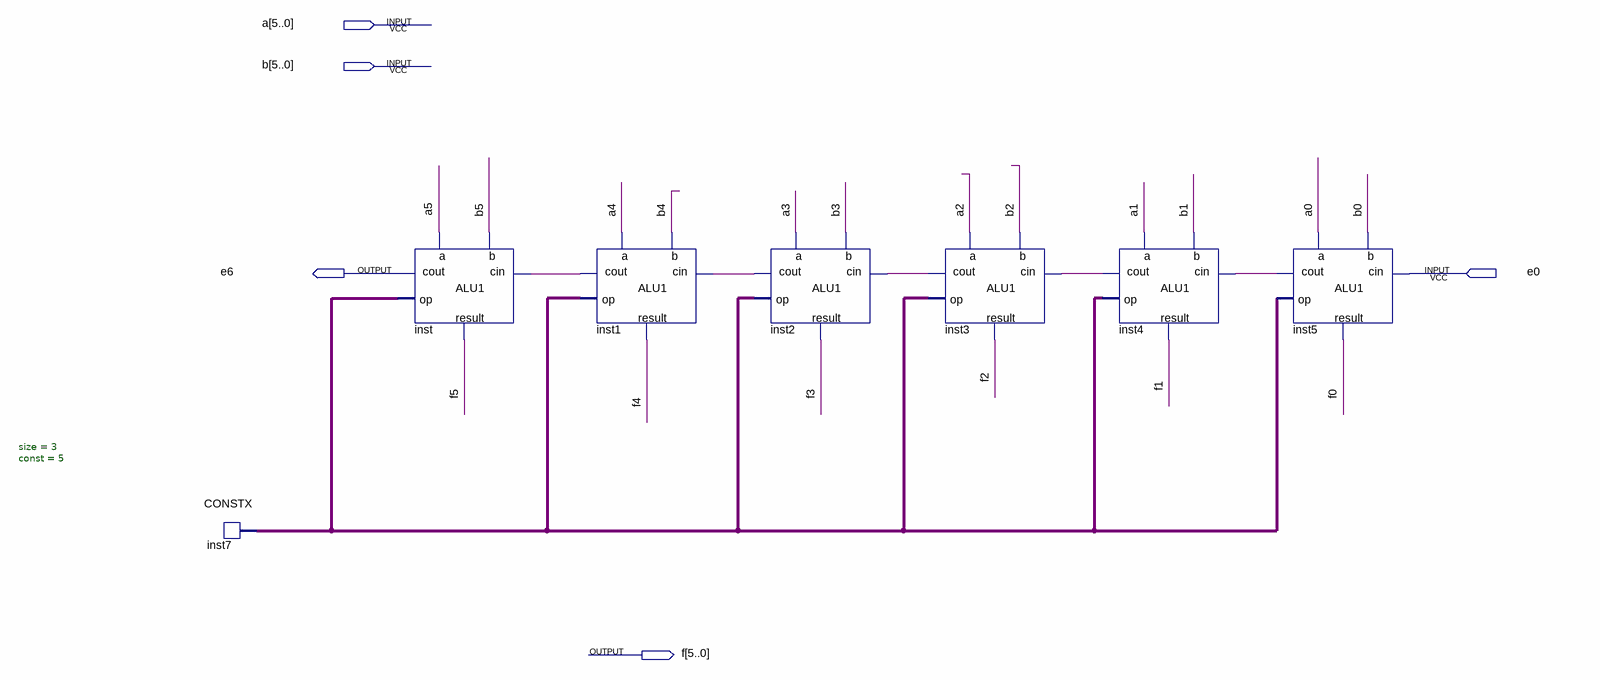
[diagram p0: schematic sheet]
// Quartus schematic SUB10new.bdf as structural Verilog: 7 symbols, 5 pins
module SUB10new (
  input  [5:0] a,
  input  [5:0] b,
  input  e0,
  output e6,
  output [5:0] f
);

  wire inst1_cout, inst2_cout, inst3_cout, inst4_cout, inst5_cout;
  wire [2:0] inst7_data;

  CONSTX #(.size(3), .\const (5)) inst7 (.data(inst7_data));
  ALU1 inst (.a(a[5]), .b(b[5]), .cin(inst1_cout), .op(inst7_data), .cout(e6), .result(f[5]));
  ALU1 inst1 (.a(a[4]), .b(b[4]), .cin(inst2_cout), .op(inst7_data), .cout(inst1_cout), .result(f[4]));
  ALU1 inst2 (.a(a[3]), .b(b[3]), .cin(inst3_cout), .op(inst7_data), .cout(inst2_cout), .result(f[3]));
  ALU1 inst3 (.a(a[2]), .b(b[2]), .cin(inst4_cout), .op(inst7_data), .cout(inst3_cout), .result(f[2]));
  ALU1 inst4 (.a(a[1]), .b(b[1]), .cin(inst5_cout), .op(inst7_data), .cout(inst4_cout), .result(f[1]));
  ALU1 inst5 (.a(a[0]), .b(b[0]), .cin(e0), .op(inst7_data), .cout(inst5_cout), .result(f[0]));
endmodule
